# EAGLE design myRadioBreakout (EAGLE 7.6.0)
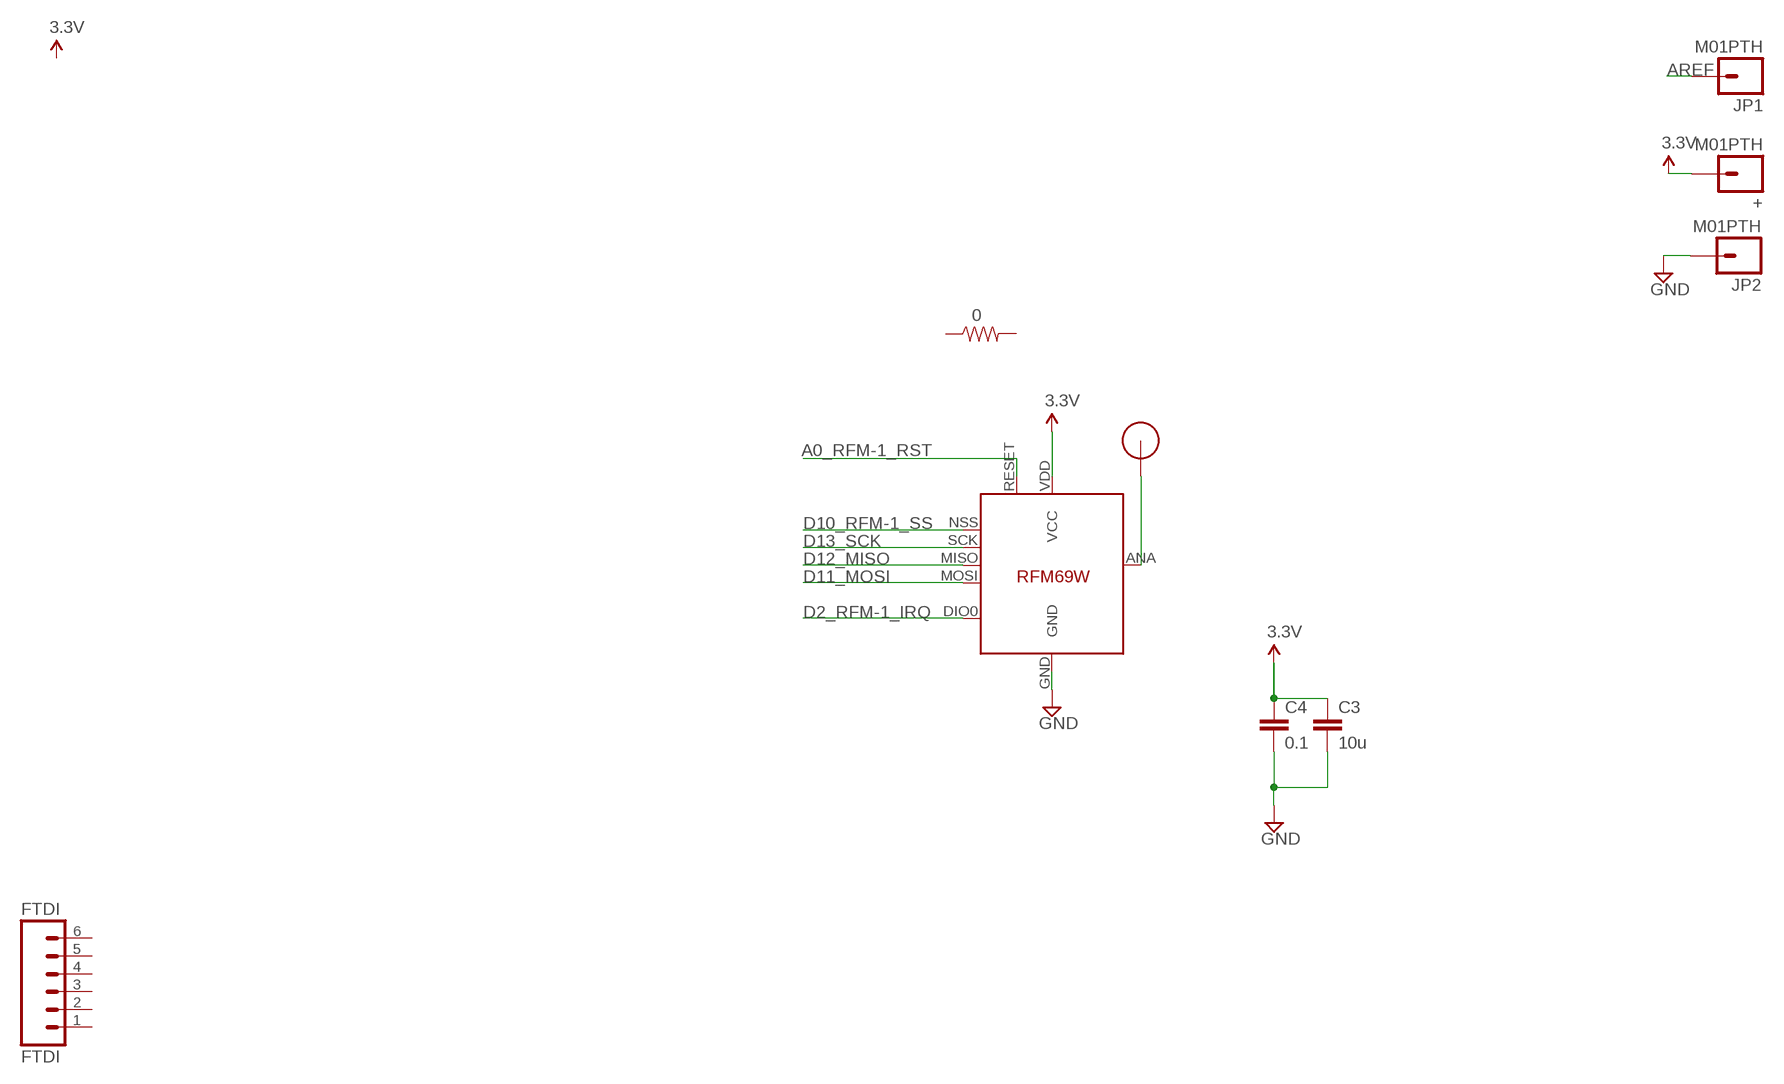
[diagram p0: schematic, sheet 1]

## Parts
+  M01PTH  [1X01]
C3  10u  CAP0805-CAP  [0805-CAP]
C4  0.1  CAP0603-CAP  [0603-CAP]
FTDI  FTDI  M06SIP  [1X06]
JP1  M01PTH  [1X01]
JP2  M01PTH  [1X01]
R1  0  RESISTOR0603-RES  [0603-RES]
U$1  RFM12B_ANTENNA  [RFM12B-ANTENNA]
U$5  RFM69_MINIPADS  [RFM69W-MINPADS]

## Nets
A0_RFM-1_RST: U$5.RESET
AREF: JP1.1
D2_RFM-1_IRQ: U$5.DIO0(DIO0/IRQ)
D10_RFM-1_SS: U$5.NSS(SEL)
D11_MOSI: U$5.MOSI
D12_MISO: U$5.MISO
D13_SCK: U$5.SCK
GND [power]: C3.2 C4.2 JP2.1 U$5.GND
N$3: U$1.P$1 U$5.ANA(ANT)
VCC: +.1 C3.1 C4.1 U$5.VDD(VCC) ; supply symbol labelled 3.3V
Unconnected: FTDI.1 FTDI.2 FTDI.3 FTDI.4 FTDI.5 FTDI.6 R1.1 R1.2

## Library data of the parts
+ JP1 JP2 = SparkFun-Connectors:M01: Header 1 Standard 1-pin 0.1" header. Use with straight break away headers (SKU : PRT-00116), right angle break away headers (PRT-00553), swiss pins (PRT-00743), machine pins (PRT-00117), and female headers (PRT-00115).
C3 = LowPowerLab:CAP: Capacitor Standard 0603 ceramic capacitor, and 0.1" leaded capacitor.; BUERKLIN: 53 D 2432
C4 = LowPowerLab:CAP: Capacitor Standard 0603 ceramic capacitor, and 0.1" leaded capacitor.; BUERKLIN: 53 D 1726
FTDI = SparkFun-Connectors:M06: Header 6 Standard 6-pin 0.1" header. Use with straight break away headers (SKU : PRT-00116), right angle break away headers (PRT-00553), swiss pins (PRT-00743), machine pins (PRT-00117), and female headers (PRT-00115). Molex polarized connector foot print use with SKU : PRT-08094 with associated crimp pins and housings. NOTES ON THE VARIANTS LOCK and LOCK_LONGPADS... This footprint was designed to help hold the alignment of a through-hole component (i.e. 6-pin header) while soldering it into place. You may notice that each hole has been shifted either up or down by 0.005 of an inch from it's more standard position (which is a perfectly straight line). This slight alteration caused the pins (the squares in the middle) to touch the edges of the holes. Because they are alternating, it causes a "brace" to hold the component in place. 0.005 has proven to be the perfect amount of "off-center" position when using our standard breakaway headers. Although looks a little odd when you look at the bare footprint, once you have a header in there, the alteration is very hard to notice. Also, if you push a header all the way into place, it is covered up entirely on the bottom side. This idea of altering the position of holes to aid alignment will be further integrated into the Sparkfun Library for other footprints. It can help hold any component with 3 or more connection pins.; BUERKLIN: 59 F 2134
R1 = LowPowerLab:RESISTOR: Resistor Basic schematic elements and footprints for 0603, 1206, and PTH resistors.; BUERKLIN: 26 E 816
U$1 = LowPowerLab:RFM12B_ANTENNA
U$5 = myLib:RFM69_MINIPADS

## Net classes
0 default: width 0.305 mm, clearance 0.254 mm
1 power: width 0.381 mm, clearance 0.254 mm

## Board
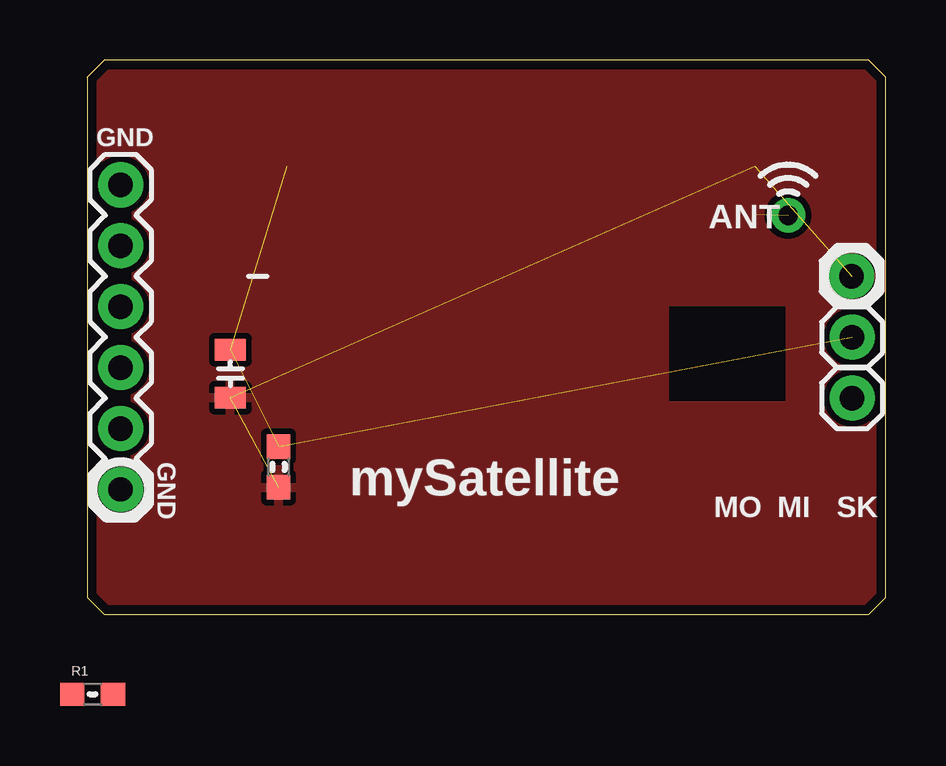
[diagram p1: board, top side]
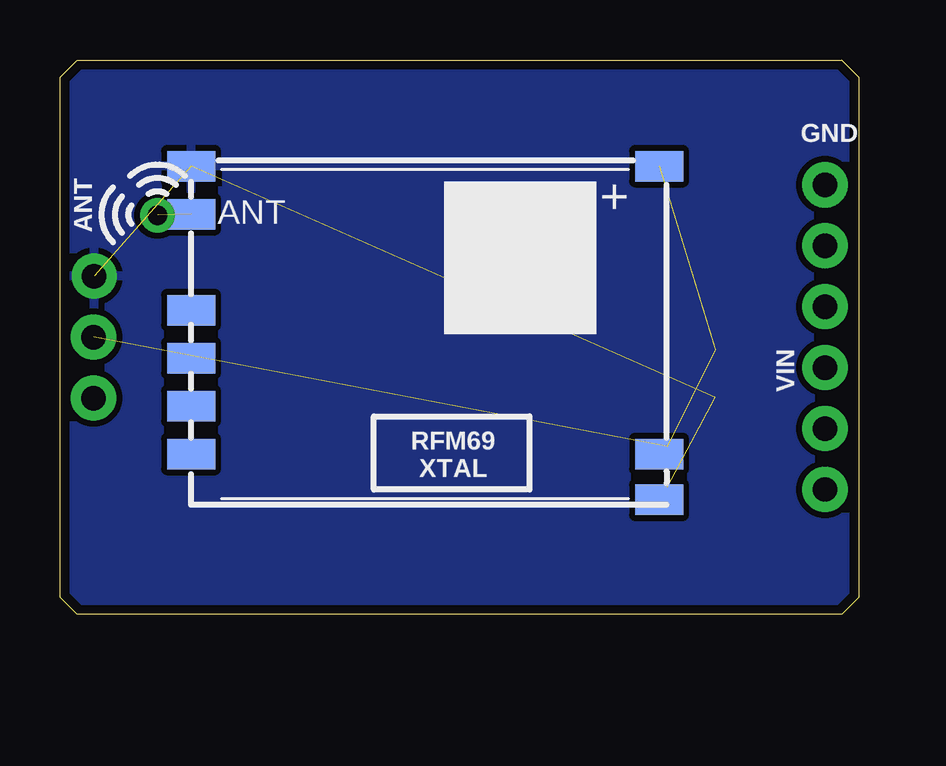
[diagram p2: board, bottom side, seen from below]

Size 33.27 x 23.11 mm. Coordinates in mm from the lower left corner, seen from the top.
Outline: 0.71,0 32.56,0 33.27,0.71 33.27,22.4 32.56,23.11 0.71,23.11 0,22.4 0,0.71 0.71,0
Copper layers (1*16): Top 0.0356mm / dielectric 1.5011mm / Bottom 0.0356mm
Design rules "oshpark-2layer *": minimum track width 6mil, minimum drill 13mil, track to track 6mil, track to pad 6mil, pad to pad 6mil, via to via 6mil, smd to smd 6mil, copper to edge 15mil, drill to drill 6mil, minimum pad ring 7mil, minimum via ring 7mil, stop-mask expansion 2.5mil, vias tented up to drill 100mil, thermal gap 10mil
tRestrict: area 24.3,8.9 to 29.1,12.8
bRestrict: area 26.5,17.9 to 27.1,18.5

### Footprints (pad centres in the part's own frame; a part is rotated, then mirrored left to right if it is on the bottom)
1X01 = drill 1.016 pad 1.88: 1 0,0
0805-CAP = smd 0.902 x 1.3: 1 -1,0; 2 1,0
0603-CAP = smd 1.016 x 0.965: 1 -0.85,0; 2 0.85,0
1X06 = drill 1.016 pad 1.88: 1 0,0; 2 2.54,0; 3 5.08,0; 4 7.62,0; 5 10.16,0; 6 12.7,0
0603-RES = smd 1.016 x 0.965: 1 -0.85,0; 2 0.85,0
RFM12B-ANTENNA = drill 0.8 pad 1.422: P$1 0,0
RFM69W-MINPADS = smd 2 x 1.27: ANA 8,-5; DIO0 -11.5,5; GND 8,-7; MISO 8,1; MOSI 8,3; NSS 8,5; RESET -11.5,6.909; SCK 8,-1; VDD -11.5,-7

### Placement (x,y rotation side)
+  31.88,11.56 270 top
C3  5.97,10.03 270 top
C4  7.98,6.15 270 top
FTDI  1.4,5.21 90 top
JP1  31.88,9.02 0 top
JP2  31.85,14.1 0 top
R1  0.23,-3.33 0 top  (outside the outline)
U$1  29.21,16.64 0 top
U$5  19.81,11.68 180 bottom

### Tracks (layer width: path | path; a pad name or v marks a point on that pad's centre or on a via)
GND  (3 unrouted)
  pour Bottom: -0.64,24 -0.76,-0.76 36.4,-1.83 34.04,24
  pour Top: -0.64,24 -1.12,-0.81 34.62,-0.69 34.04,24
N$3  (1 unrouted)
VCC  (3 unrouted)

### Text on the board
tPlace: mySatellite
bPlace: RFM69 / XTAL
tDocu: REG
_tsilk: GND | ANT | GND | MO | MI | SK
_bsilk: GND | ANT | VIN